# EasyEDA Pro project TinyFOC一体驱动板.epro

# Schematic Schematic1
Create Date: 2025-08-07; Page Name: P1; Project Name: FOC一体驱动板; Schematic Name: Schematic1; Update Date: 2025-08-23; Company: 湖南师范大学; Page Size: A4; Version: V1.0
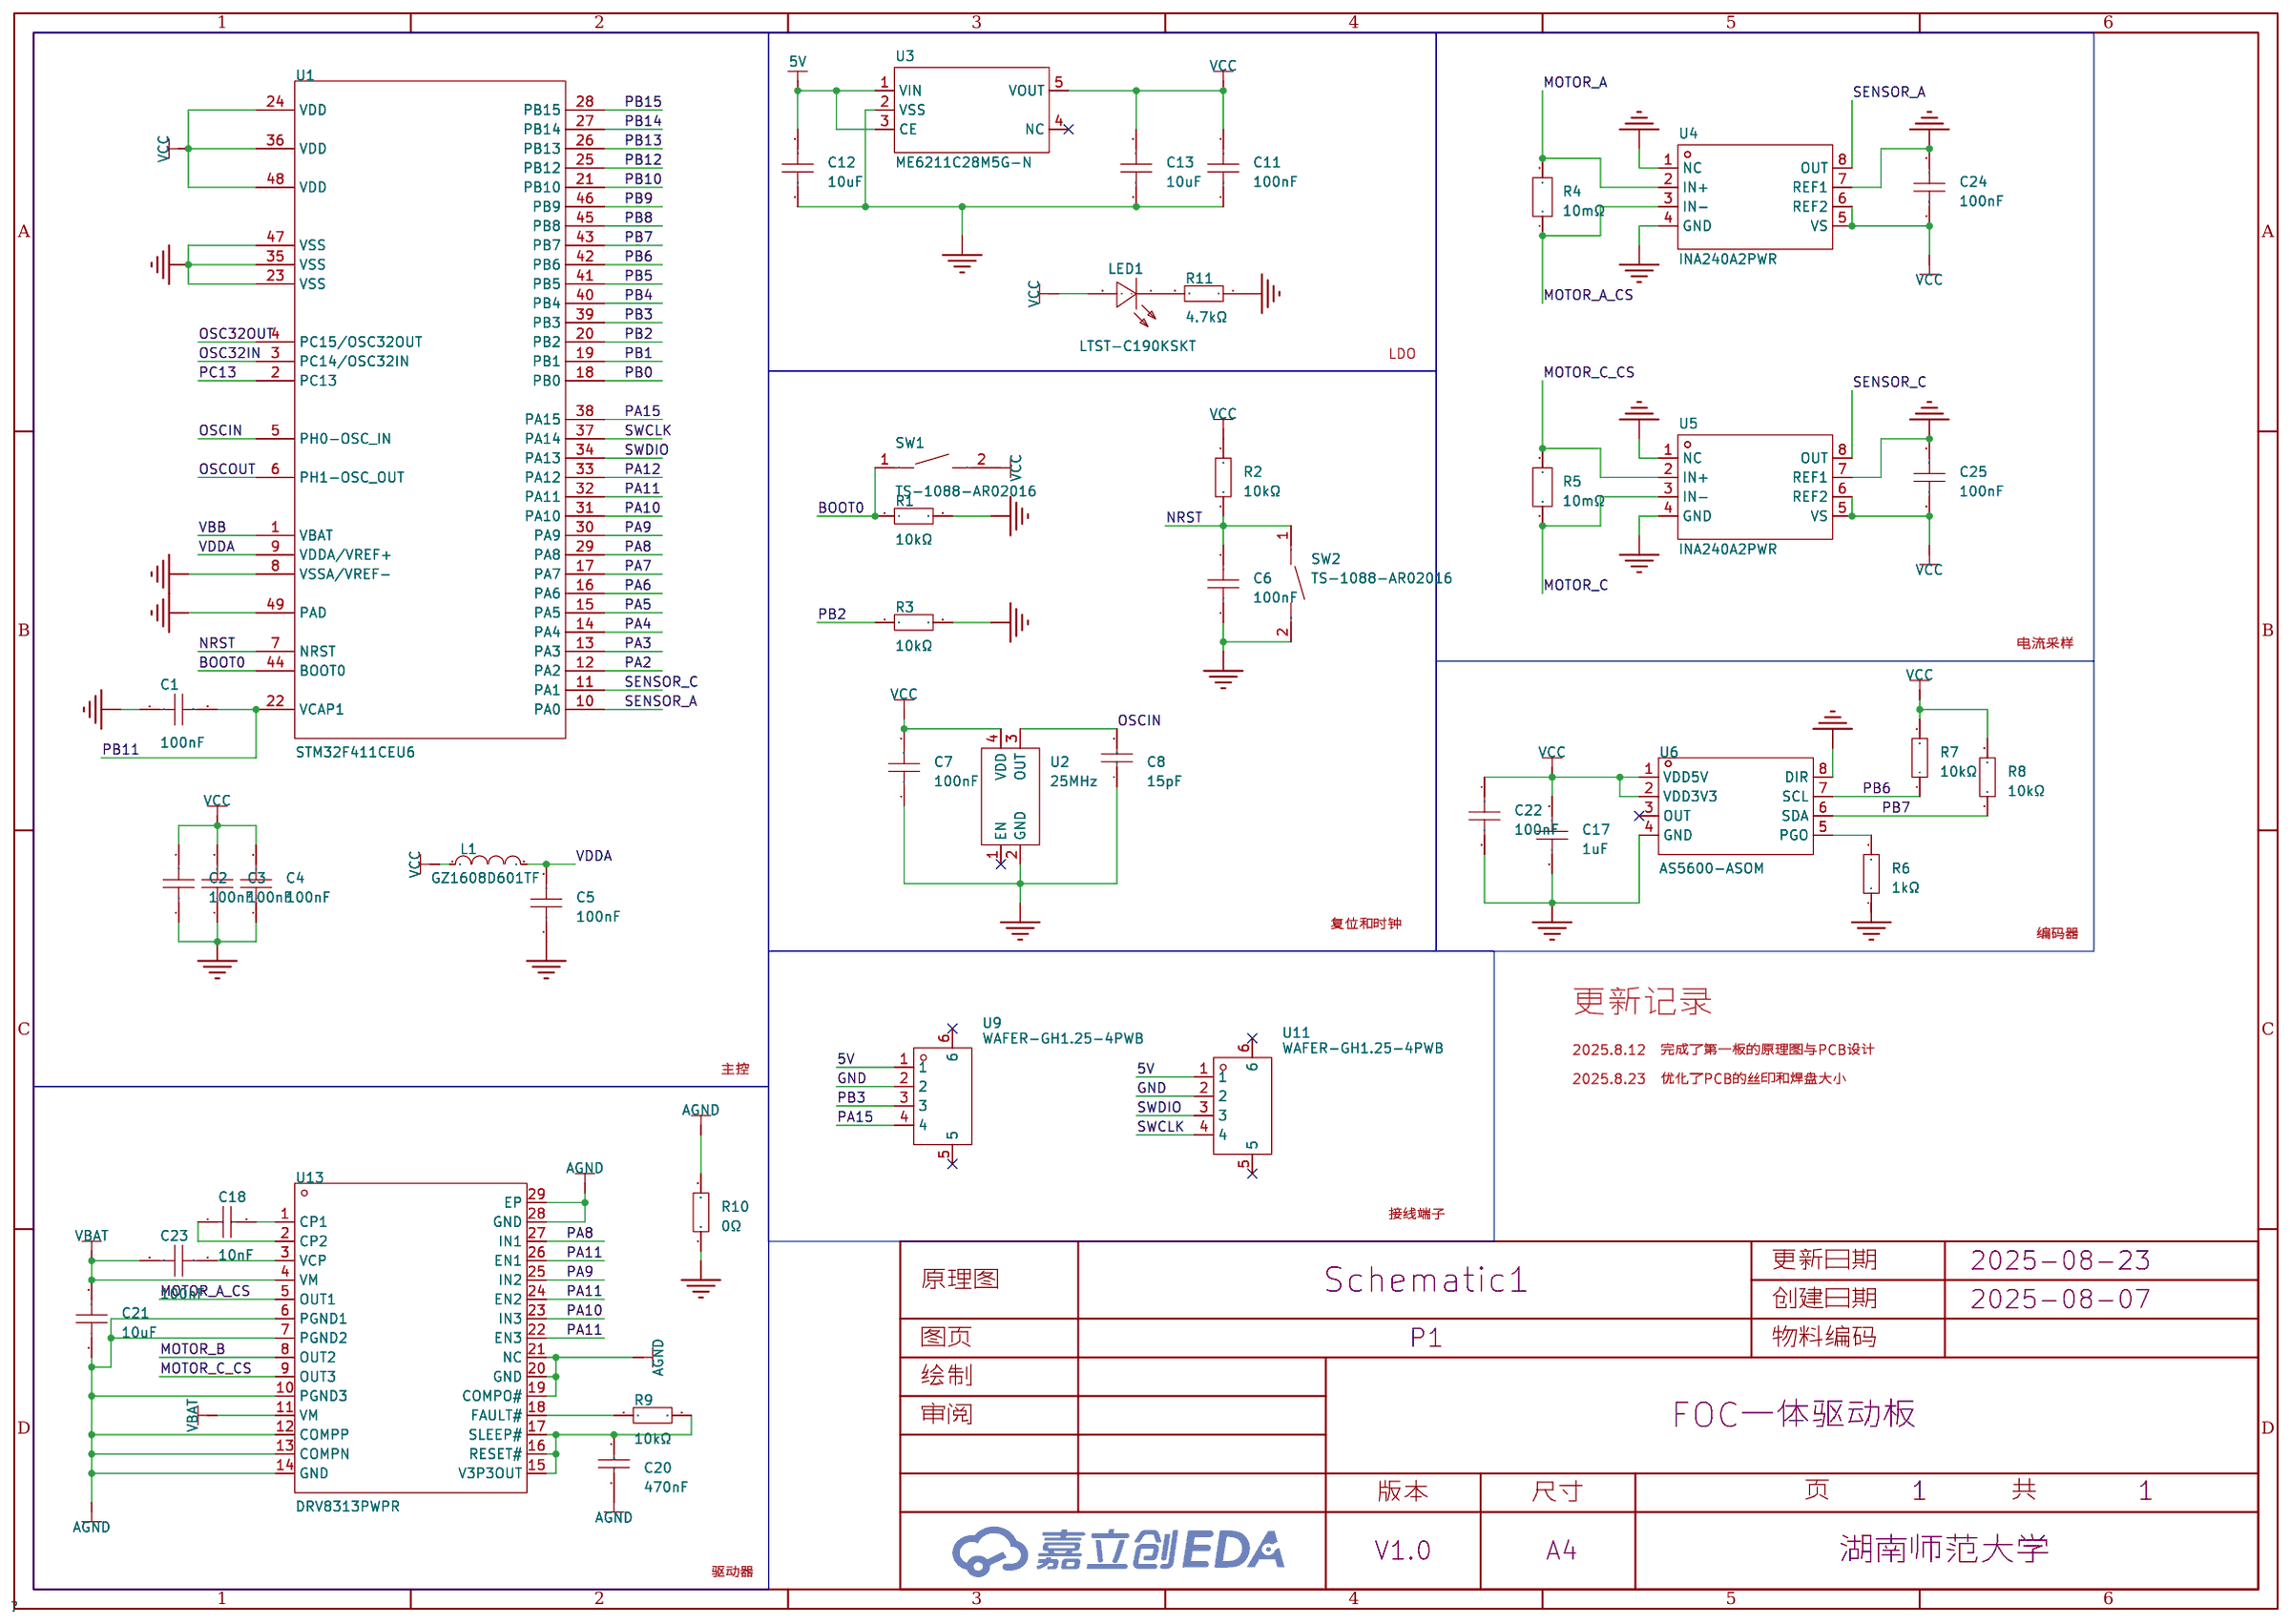
[diagram p0: schematic sheet]

## Parts
C1  100nF  [C0603]
C2  100nF  [C0603]
C3  100nF  [C0603]
C4  100nF  [C0603]
C5  100nF  [C0603]
C6  100nF  [C0603]
C7  100nF  [C0603]
C8  15pF  [C0603]
C11  100nF  [C0603]
C12  10uF  [C0603]
C13  10uF  [C0603]
C17  1uF  [C0603]
C18  10nF  [C0805]
C20  470nF  [C0603]
C21  10uF  [C0603]
C22  100nF  [C0603]
C23  100nF  [C0603]
C24  100nF  [C0603]
C25  100nF  [C0603]
L1  GZ1608D601TF  [L0603]
LED1  LTST-C190KSKT  [LED0603-RD]
R1  10kΩ  [R0603]
R2  10kΩ  [R0603]
R3  10kΩ  [R0603]
R4  10mΩ  [R1206]
R5  10mΩ  [R1206]
R6  1kΩ  [R0603]
R7  10kΩ  [R0603]
R8  10kΩ  [R0603]
R9  10kΩ  [R0603]
R10  0Ω  [R0603]
R11  4.7kΩ  [R0603]
SW1  TS-1088-AR02016  [SW-SMD_L3.9-W3.0-P4.45]
SW2  TS-1088-AR02016  [SW-SMD_L3.9-W3.0-P4.45]
U1  STM32F411CEU6  [UFQFPN-48_L7.0-W7.0-P0.50-BL-EP]
U2  25MHz  [OSC-SMD_4P-L2.0-W1.6-BL]
U3  ME6211C28M5G-N  [SOT-23-5_L3.0-W1.7-P0.95-LS2.8-BR]
U4  INA240A2PWR  [TSSOP-8_L4.4-W3.0-P0.65-LS6.4-BL]
U5  INA240A2PWR  [TSSOP-8_L4.4-W3.0-P0.65-LS6.4-BL]
U6  AS5600-ASOM  [SOIC-8_L5.0-W4.0-P1.27-LS6.0-BL]
U9  WAFER-GH1.25-4PWB  [CONN-SMD_4P-P1.25_XUNPU_WAFER-GH1.25-4PWB]
U11  WAFER-GH1.25-4PWB  [CONN-SMD_4P-P1.25_XUNPU_WAFER-GH1.25-4PWB]
U13  DRV8313PWPR  [HTSSOP-28_L9.8-W4.5-P0.65-LS6.6-BL-EP]

## Library data of the parts
C1-C7 C11 C22-C25 = CGA0603X7R104K500JT: 容值:100nF;精度:±10%;额定电压:50V;温度系数:X7R;; LCSC Part Name: 100nF ±10% 50V; Supplier Part: C6119867; Manufacturer: HRE(芯声); Supplier Footprint: 0603; JLCPCB Part Class: 扩展库; Datasheet: https://atta.szlcsc.com/upload/public/pdf/source/20250103/C44077DA9E7B3EFAE02F22B6D3D1CBC9.pdf; Supplier: LCSC; Tolerance: ±10%; Voltage Rating: 50V; Temperature Coefficient: X7R
C8 = CL10C150JB8NNNC: 容值:15pF;精度:±5%;额定电压:50V;材质(温度系数):C0G;; LCSC Part Name: 15pF ±5% 50V; Supplier Part: C1644; Manufacturer: SAMSUNG(三星); Supplier Footprint: 0603; JLCPCB Part Class: 基础库; Datasheet: https://atta.szlcsc.com/upload/public/pdf/source/20160218/1457707763339.pdf; Supplier: LCSC; Tolerance: ±5%; Voltage Rated: 50V; Temperature Coefficient: C0G
C12 C13 = CL10A106KP8NNNC: 容值:10uF;精度:±10%;额定电压:10V;材质(温度系数):X5R;; LCSC Part Name: 10uF ±10% 10V; Supplier Part: C19702; Manufacturer: SAMSUNG(三星); Supplier Footprint: 0603; JLCPCB Part Class: 基础库; Datasheet: https://atta.szlcsc.com/upload/public/pdf/source/20160218/1457707763339.pdf; Supplier: LCSC; Tolerance: ±10%; Voltage Rated: 10V; Temperature Coefficient: X5R
C17 = CL10A105KB8NNNC: 容值:1uF;精度:±10%;额定电压:50V;材质(温度系数):X5R;; LCSC Part Name: 1uF ±10% 50V; Supplier Part: C15849; Manufacturer: SAMSUNG(三星); Supplier Footprint: 0603; JLCPCB Part Class: 基础库; Datasheet: https://atta.szlcsc.com/upload/public/pdf/source/20160218/1457707763339.pdf; Supplier: LCSC; Tolerance: ±10%; Voltage Rated: 50V; Temperature Coefficient: X5R
C18 = CL21B103KBANNNC: 容值:10nF;精度:±10%;额定电压:50V;材质(温度系数):X7R;; LCSC Part Name: 10nF ±10% 50V; Supplier Part: C1710; Manufacturer: SAMSUNG(三星); Supplier Footprint: 0805; JLCPCB Part Class: Basic Part; Datasheet: https://atta.szlcsc.com/upload/public/pdf/source/20160218/1457707763339.pdf; Supplier: LCSC; Tolerance: ±10%; Voltage Rated: 50V; Temperature Coefficient: X7R
C20 = CL10B474KA8NNNC: 容值:470nF;精度:±10%;额定电压:25V;材质(温度系数):X7R;; LCSC Part Name: 470nF ±10% 25V; Supplier Part: C1623; Manufacturer: SAMSUNG(三星); Supplier Footprint: 0603; JLCPCB Part Class: 基础库; Datasheet: https://atta.szlcsc.com/upload/public/pdf/source/20160218/1457707763339.pdf; Supplier: LCSC; Tolerance: ±10%; Voltage Rated: 25V; Temperature Coefficient: X7R
C21 = CL10A106MA8NRNC: 容值:10uF;精度:±20%;额定电压:25V;材质(温度系数):X5R;; LCSC Part Name: 10uF ±20% 25V; Supplier Part: C96446; Manufacturer: SAMSUNG(三星); Supplier Footprint: 0603; JLCPCB Part Class: 基础库; Datasheet: https://atta.szlcsc.com/upload/public/pdf/source/20160218/1457707763339.pdf; Supplier: LCSC; Tolerance: ±20%; Voltage Rated: 25V; Temperature Coefficient: X5R
L1 = GZ1608D601TF: 阻抗 @ 频率:600Ω@100MHz;误差:±25%;直流电阻(DCR):450mΩ;; LCSC Part Name: 单路 0603磁珠 阻抗600Ω@100MHz; Supplier Part: C1002; Manufacturer: Sunlord(顺络); Supplier Footprint: 0603; JLCPCB Part Class: 基础库; Datasheet: https://atta.szlcsc.com/upload/public/pdf/source/20241120/893429B990C3BA07384E734821D2F218.pdf; Supplier: LCSC; Impedance @ Frequency: 600Ω@100MHz; Tolerance: ±25%; DC Resistance: 450mΩ; Current Rating: 200mA; Circuits: 1
LED1 = LTST-C190KSKT: 发光颜色:黄色;正向电压(VF):2.1V;功率:75mW;正向电流:20mA;主波长:584.5nm~597nm;二极管配置:-;透镜颜色:无色透明透镜;色温:-;发光强度:104mcd;发光角度:130°;载带方式:-;工作温度:-30℃~+85℃;; LCSC Part Name: 黄灯; Supplier Part: C125095; Manufacturer: LITEON(光宝); Supplier Footprint: 0603; JLCPCB Part Class: 扩展库; Datasheet: https://atta.szlcsc.com/upload/public/pdf/source/20180129/C125095_15171881843821315881.pdf; Supplier: LCSC; Emitted Color: 黄色; Forward Voltage (VF): 2.1V; Power Dissipation: 75mW; Forward Current: 20mA; Dominant Wavelength: 584.5nm~597nm; Peak Wavelength: 588nm; Lens Color: 无色透明透镜; Luminous Intensity: 104mcd; Viewing Angle: 130°; Operating Temperature: -30℃~+85℃
R1-R3 R7-R9 = 0603WAF1002T5E: 电阻类型:厚膜电阻;阻值:10kΩ;精度:±1%;功率:100mW;工作电压:75V;温度系数:±100ppm/℃;; LCSC Part Name: 厚膜电阻 10kΩ ±1% 100mW; Supplier Part: C25804; Manufacturer: UNI-ROYAL(厚声); Supplier Footprint: 0603; JLCPCB Part Class: 基础库; Datasheet: https://atta.szlcsc.com/upload/public/pdf/source/20200306/C422600_1E6D84923E4A46A82E41ADD87F860B5C.pdf; Supplier: LCSC; Type: 厚膜电阻; Tolerance: ±1%; Power(Watts): 100mW; Voltage-Supply(Max): 75V; Temperature Coefficient: ±100ppm/℃; Operating Temperature: -55℃~+155℃
R4 R5 = JER1206F1R010: 电阻类型:采样电阻;阻值:10mΩ;精度:±1%;功率:1W;温度系数:±50ppm/℃;; LCSC Part Name: 10mΩ 1W 1206 ±1%; Supplier Part: C46634437; Manufacturer: 捷而瑞; Supplier Footprint: 1206; JLCPCB Part Class: 扩展库; Datasheet: https://atta.szlcsc.com/upload/public/pdf/source/20250318/D554CC95569B02A455FAE3D181D671EA.pdf; Supplier: LCSC; Type: 采样电阻; Tolerance: ±1%; Power(Watts): 1W; Temperature Coefficient: ±50ppm/℃
R6 = 0603WAF1001T5E: 电阻类型:厚膜电阻;阻值:1kΩ;精度:±1%;功率:100mW;最大工作电压:75V;温度系数:±100ppm/℃;; LCSC Part Name: 1kΩ ±1% 100mW 厚膜电阻; Supplier Part: C21190; Manufacturer: UNI-ROYAL(厚声); Supplier Footprint: 0603; JLCPCB Part Class: 基础库; Datasheet: https://atta.szlcsc.com/upload/public/pdf/source/20200306/C422600_1E6D84923E4A46A82E41ADD87F860B5C.pdf; Supplier: LCSC; Type: 厚膜电阻; Tolerance: ±1%; Power(Watts): 100mW; Overload Voltage (Max): 75V; Temperature Coefficient: ±100ppm/℃; Operating Temperature Range: -55℃~+155℃
R10 = 0603WAF0000T5E: 电阻类型:厚膜电阻;阻值:0Ω;精度:±1%;功率:100mW;工作电压:75V;; LCSC Part Name: 0Ω ±1% 100mW 厚膜电阻; Supplier Part: C21189; Manufacturer: UNI-ROYAL(厚声); Supplier Footprint: 0603; JLCPCB Part Class: 基础库; Datasheet: https://atta.szlcsc.com/upload/public/pdf/source/20200306/C422600_1E6D84923E4A46A82E41ADD87F860B5C.pdf; Supplier: LCSC; Type: 厚膜电阻; Tolerance: ±1%; Power(Watts): 100mW; Voltage-Supply(Max): 75V; Operating Temperature: -55℃~+155℃
R11 = 0603WAF4701T5E: 电阻类型:厚膜电阻;阻值:4.7kΩ;精度:±1%;功率:100mW;最大工作电压:75V;温度系数:±100ppm/℃;; LCSC Part Name: 4.7kΩ ±1% 100mW 厚膜电阻; Supplier Part: C23162; Manufacturer: UNI-ROYAL(厚声); Supplier Footprint: 0603; JLCPCB Part Class: 基础库; Datasheet: https://atta.szlcsc.com/upload/public/pdf/source/20200306/C422600_1E6D84923E4A46A82E41ADD87F860B5C.pdf; Supplier: LCSC; Type: 厚膜电阻; Tolerance: ±1%; Power(Watts): 100mW; Overload Voltage (Max): 75V; Temperature Coefficient: ±100ppm/℃; Operating Temperature Range: -55℃~+155℃
SW1 SW2 = TS-1088-AR02016: 电路结构:单刀单掷;按钮形状:圆形按钮;作用力:160gf;安装方式:立贴;开关长度:4mm;开关宽度:3mm;开关高度:2mm;带支架:不带;触点电流:50mA;额定电压(DC):12V;绝缘电阻:100MΩ;机械寿命:10万次;; LCSC Part Name: 4*3*2mm 立贴 轻触开关; Supplier Part: C720477; Manufacturer: XUNPU(讯普); Supplier Footprint: SMD; JLCPCB Part Class: 基础库; Datasheet: https://atta.szlcsc.com/upload/public/pdf/source/20200810/C720475_60D09DD6C54279ADDB2DC25100F1CC11.pdf; Supplier: LCSC; Circuit: 单刀单掷; Actuator Style: 圆形按钮; Operating Force: 160gf; Mounting Style: 立贴; Switch Length: 4mm; Switch Width: 3mm; Switch Height: 2mm; Strike Gundam: 不带; Contact Current: 50mA; Voltage Rating (DC): 12V; Insulation Resistance: 100MΩ; Actuator/Cap Color: 黑色; Pin Style: SMD接片; Mechanical Life: 10万次; Operating Temperature: -30℃~+80℃
U1 = STM32F411CEU6: CPU内核:ARM-M4;CPU最大主频:100MHz;应用领域:-;; LCSC Part Name: 带DSP和FPU的高性能基本型系列ARM Cortex-M4 MCU，具有512 KB Flash、100 MHz CPU和ART加速器; Supplier Part: C60420; Manufacturer: ST(意法半导体); Supplier Footprint: UFQFPN-48(7x7); JLCPCB Part Class: 扩展库; Datasheet: https://atta.szlcsc.com/upload/public/pdf/source/20151026/1457707507170.pdf; Supplier: LCSC; CPU Core: ARM-M4; CPU Maximum Speed: 100MHz; Program Storage Size: 512KB; Program Memory Type: FLASH; Number of I/O: 36; ADC (Bit): 12bit; Voltage - Supply: 1.7V~3.6V
U2 = 8T025000301: 频率:25MHz;; LCSC Part Name: 25M 3.3V -40~85度30ppm; Supplier Part: C5184806; Manufacturer: HD(浩都频率); Supplier Footprint: SMD2016-4P; JLCPCB Part Class: 扩展库; Datasheet: https://atta.szlcsc.com/upload/public/pdf/source/20221108/A0608134A307B3F202D8F841D0A911F4.pdf; Supplier: LCSC
U3 = ME6211C28M5G-N: 输出类型:固定;工作电压:6V;输出电压:2.8V;输出电流:450mA;电源纹波抑制比(PSRR):70dB@(1kHz);输出极性:正极;; LCSC Part Name: 输入6V 输出2.8V 450mA; Supplier Part: C53099; Manufacturer: MICRONE(南京微盟); Supplier Footprint: SOT-23-5; JLCPCB Part Class: 扩展库; Datasheet: https://atta.szlcsc.com/upload/public/pdf/source/20171014/C53099_15079757529561038531.pdf; Supplier: LCSC; Output Type: 固定; Voltage - Supply: 6V; Output Voltage: 2.8V; Output Current: 450mA; Power Supply Rejection Ratio (PSRR): 70dB@(1kHz); Voltage Dropout: 220mV@(200mA); Features: 低ESR；带使能; Output Configuration: 正极; Number of Outputs: 1
U4 U5 = INA240A2PWR: 放大器数:单路;; Supplier Part: C129949; Manufacturer: TI(德州仪器); Supplier Footprint: TSSOP-8; JLCPCB Part Class: 扩展库; Datasheet: https://www.ti.com/cn/lit/gpn/ina240; Supplier: LCSC; Number of Channels: 单路; Supply Current: 1.8mA; Operating Temperature: -40℃~+125℃
U6 = AS5600-ASOM: 旋转角度范围:0°~360°;; Supplier Part: C79815; Manufacturer: ams(艾迈斯半导体); Supplier Footprint: SOIC-8; JLCPCB Part Class: 扩展库; Datasheet: https://atta.szlcsc.com/upload/public/pdf/source/20161027/1477535527192.pdf; Supplier: LCSC; Supply Voltage: 5V；3.3V; Rotation Angle: 0°~360°
U9 U11 = WAFER-GH1.25-4PWB: 插针结构:1x4P;间距:1.25mm;安装方式:卧贴;参考系列:GH;总PIN数:4P;排数:1;每排PIN数:4;行距:-;额定电流:1A;触头材质:黄铜;触头镀层:-;工作温度范围:-25℃~+85℃;; LCSC Part Name: 1x4P 间距:1.25mm 卧贴 系列:GH; Supplier Part: C3029379; Manufacturer: XUNPU(讯普); Supplier Footprint: SMD,P=1.25mm,卧贴; JLCPCB Part Class: 扩展库; Datasheet: https://atta.szlcsc.com/upload/public/pdf/source/20220527/CB8773BFB0913C3B8ABD62CB38BA101A.pdf; Supplier: LCSC; Pins Structure: 1x4P; Pitch: 1.25mm; Mounting Type: 卧贴; Reference Series: GH; Number of Pins: 4P; Number of Rows: 1; Number of PINs Per Row: 4; Current Rating: 1A; Contact Material: 黄铜; Operating Temperature: -25℃~+85℃; Voltage Rating: 125V; Plastic Material: LCP; Supplementary Features: 辅助焊脚; Color: 米色; Z-Height of the Board: 4.35mm; X-Length of Bottom Edge on Board (Spacing Line): 8.25mm; Y-Width of Bottom Edge on Board: 5mm
U13 = DRV8313PWPR: DRV8313 具有集成 FET、65V 最大电压、3A 峰值电流的三相电机驱动器; LCSC Part Name: 无刷直流BLDC电机驱动芯片 60V; Supplier Part: C92482; Manufacturer: TI(德州仪器); Supplier Footprint: HTSSOP-28-EP-4.5mm; JLCPCB Part Class: 扩展库; Datasheet: https://www.ti.com/cn/lit/gpn/drv8313; Supplier: LCSC

## Nets
5V: C12.2 U3.1(VIN) U3.3(CE) U9.1 U11.1
AGND: C20.1 C21.1 R10.2 U13.6(PGND1) U13.7(PGND2) U13.10(PGND3) U13.12(COMPP) U13.13(COMPN) U13.14(GND) U13.19(COMPO#) U13.20(GND) U13.21(NC) U13.28(GND) U13.29(EP)
GND: C1.1 C2.1 C3.1 C4.1 C5.1 C6.2 C7.1 C8.1 C11.1 C12.1 C13.1 C17.1 C22.2 C24.2 C25.2 R1.2 R3.2 R6.1 R10.1 R11.1 SW2.2 U1.8(VSSA/VREF-) U1.23(VSS) U1.35(VSS) U1.47(VSS) U1.49(PAD) U2.2(GND) U3.2(VSS) U4.1(NC) U4.4(GND) U4.7(REF1) U5.1(NC) U5.4(GND) U5.7(REF1) U6.4(GND) U6.8(DIR) U9.2 U11.2
VBAT: C21.2 C23.2 U13.4(VM) U13.11(VM)
VCC: C2.2 C3.2 C4.2 C7.2 C11.2 C13.2 C17.2 C22.1 C24.1 C25.1 L1.1 LED1.2(+) R2.1 R7.2 R8.2 SW1.2 U1.24(VDD) U1.36(VDD) U1.48(VDD) U2.4(VDD) U3.5(VOUT) U4.5(VS) U4.6(REF2) U5.5(VS) U5.6(REF2) U6.1(VDD5V) U6.2(VDD3V3)
VDDA: C5.2 L1.2 U1.9(VDDA/VREF+)
BOOT0: R1.1 SW1.1 U1.44(BOOT0)
MOTOR_A: R4.2 U4.2(IN+)
MOTOR_A_CS: R4.1 U4.3(IN-) U13.5(OUT1)
MOTOR_B: U13.8(OUT2)
MOTOR_C: R5.1 U5.3(IN-)
MOTOR_C_CS: R5.2 U5.2(IN+) U13.9(OUT3)
NRST: C6.1 R2.2 SW2.1 U1.7(NRST)
OSC32IN: U1.3(PC14/OSC32IN)
OSC32OUT: U1.4(PC15/OSC32OUT)
OSCIN: C8.2 U1.5(PH0-OSC_IN) U2.3(OUT)
OSCOUT: U1.6(PH1-OSC_OUT)
PA2: U1.12(PA2)
PA3: U1.13(PA3)
PA4: U1.14(PA4)
PA5: U1.15(PA5)
PA6: U1.16(PA6)
PA7: U1.17(PA7)
PA8: U1.29(PA8) U13.27(IN1)
PA9: U1.30(PA9) U13.25(IN2)
PA10: U1.31(PA10) U13.23(IN3)
PA11: U1.32(PA11) U13.22(EN3) U13.24(EN2) U13.26(EN1)
PA12: U1.33(PA12)
PA15: U1.38(PA15) U9.4
PB0: U1.18(PB0)
PB1: U1.19(PB1)
PB2: R3.1 U1.20(PB2)
PB3: U1.39(PB3) U9.3
PB4: U1.40(PB4)
PB5: U1.41(PB5)
PB6: R7.1 U1.42(PB6) U6.7(SCL)
PB7: R8.1 U1.43(PB7) U6.6(SDA)
PB8: U1.45(PB8)
PB9: U1.46(PB9)
PB10: U1.21(PB10)
PB11: C1.2 U1.22(VCAP1)
PB12: U1.25(PB12)
PB13: U1.26(PB13)
PB14: U1.27(PB14)
PB15: U1.28(PB15)
PC13: U1.2(PC13)
SENSOR_A: U1.10(PA0) U4.8(OUT)
SENSOR_C: U1.11(PA1) U5.8(OUT)
SWCLK: U1.37(PA14) U11.4
SWDIO: U1.34(PA13) U11.3
VBB: U1.1(VBAT)
$1N2682: R6.2 U6.5(PGO)
$1N3815: C18.2 U13.1(CP1)
$1N3819: C18.1 U13.2(CP2)
$1N3846: C23.1 U13.3(VCP)
$1N3991: R9.1 U13.18(FAULT#)
$1N3994: C20.2 R9.2 U13.15(V3P3OUT) U13.16(RESET#) U13.17(SLEEP#)
$1N4536: LED1.1(-) R11.2

Not connected (* = marked no-connect by the designer): U2 1(EN)*; U3 4(NC)*; U6 3(OUT)*; U9 5* 6*; U11 5* 6*

## Notes on the sheet
- LDO
- 电流采样
- 复位和时钟
- 编码器
- 更新记录
- 2025.8.12  完成了第一板的原理图与PCB设计
- 主控
- 2025.8.23  优化了PCB的丝印和焊盘大小
- 接线端子
- 驱动器

# Board PCB1
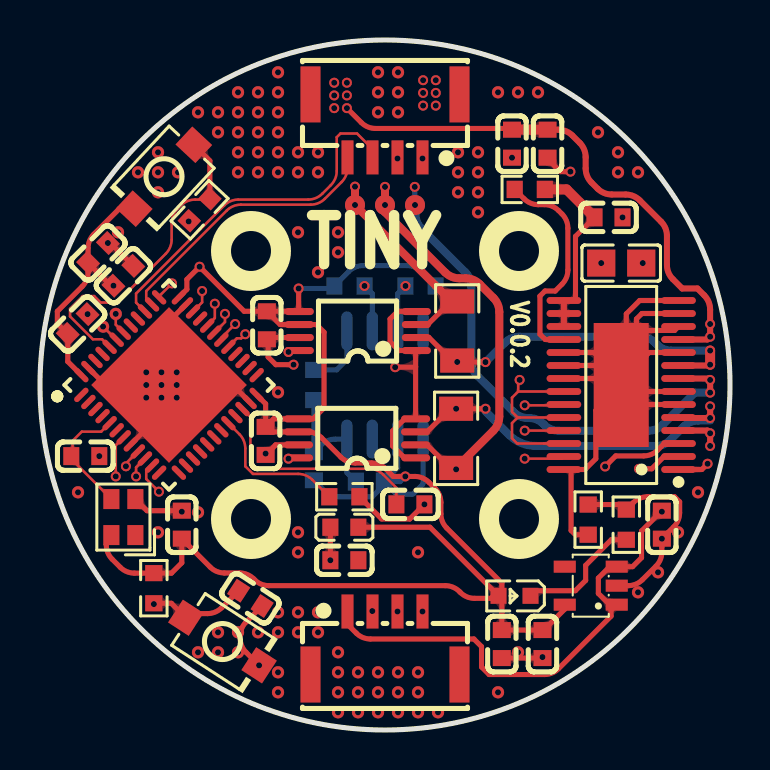
[diagram p1: board, top side]
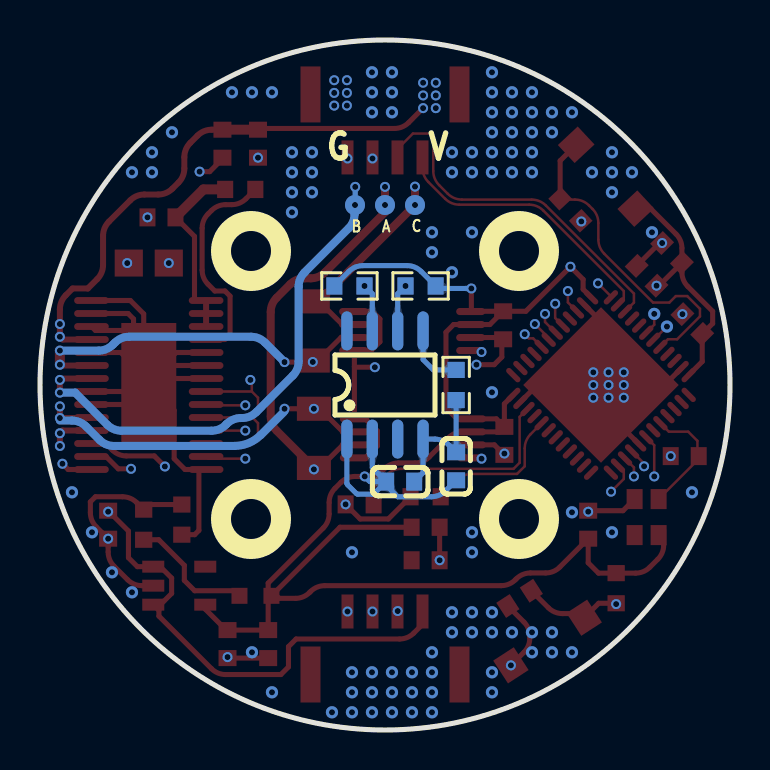
[diagram p2: board, bottom side, seen from below]

Outline 34.5 x 34.5 mm; copper layers: Top Layer, Inner1, Inner2, Bottom Layer. Coordinates in mm from the lower left corner of the outline.
Outline path: circle c17.25,17.25 r17.25
Stack: Top Layer 0.035mm 外层铜厚1oz / Dielectric1 0.2104mm 7628 RC49% 8.6mil / Inner1 0.0152mm 内层铜厚 / Dielectric2 1.065mm 1.1mm H/HOZ 含铜 / Inner2 0.0152mm 内层铜厚 / Dielectric3 0.2104mm 7628 RC49% 8.6mil / Bottom Layer 0.035mm 外层铜厚1oz

## Design rules (mm)
template: JLCPCB Capability(Two Layers Board)
spacing copperThickness1oz (default): track to track 0.102, other pairs 0.152 to 0.3
spacing copperThickness2oz: track to track 0.203, other pairs 0.152 to 0.3
track width copperThickness1oz (default): min 0.127, default 0.254, max 2.54
track width copperThickness2oz: min 0.203, default 0.254, max 2.54
differential pair differentialPair (default): width min 0.127, default 0.254, max 2.54; gap min 0.152, default 0.152
via viaSize (default): diameter min 0.5, default 0.61, max 10; hole min 0.3, default 0.305, max 6.3

## Placement (name value [footprint] x y rotation side)
C1  100nF  [C0603]  18.52 11.28 180 top
C2  100nF  [C0603]  4.17 22.71 225 top
C3  100nF  [C0603]  2.9 23.85 225 top
C4  100nF  [C0603]  1.88 20.3 225 top
C5  100nF  [C0603]  15.22 8.49 180 top
C6  100nF  [C0603]  10.52 6.58 327 top
C7  100nF  [C0603]  7.09 10.27 270 top
C8  15pF  [C0603]  2.26 13.69 180 top
C11  100nF  [C0603]  23.09 4.3 90 top
C12  10uF  [C0603]  31.09 10.27 90 top
C13  10uF  [C0603]  25.12 4.3 90 top
C17  1uF  [C0603]  16.49 12.42 0 bottom
C18  10nF  [C0805]  29.06 23.35 180 top
C20  470nF  [C0603]  28.43 25.63 180 top
C21  10uF  [C0603]  23.6 29.31 90 top
C22  100nF  [C0603]  13.69 13.19 90 bottom
C23  100nF  [C0603]  25.38 29.31 90 top
C24  100nF  [C0603]  11.28 14.46 270 top
C25  100nF  [C0603]  11.34 20.24 270 top
L1  GZ1608D601TF  [L0603]  15.22 10.14 180 top
LED1  LTST-C190KSKT  [LED0603-RD]  23.73 6.71 180 top
R1  10kΩ  [R0603]  7.98 26.01 227 top
R2  10kΩ  [R0603]  5.69 7.09 270 top
R3  10kΩ  [R0603]  15.22 11.66 0 top
R4  10mΩ  [R1206]  20.81 14.58 270 top
R5  10mΩ  [R1206]  20.86 19.95 270 top
R6  1kΩ  [R0603]  13.69 17.25 90 bottom
R7  10kΩ  [R0603]  19.03 22.2 0 bottom
R8  10kΩ  [R0603]  15.47 22.2 180 bottom
R9  10kΩ  [R0603]  24.49 27.03 0 top
R10  0Ω  [R0603]  27.41 10.52 270 top
R11  4.7kΩ  [R0603]  29.31 10.27 270 top
SW1  TS-1088-AR02016  [SW-SMD_L3.9-W3.0-P4.45]  6.2 27.66 227 top
SW2  TS-1088-AR02016  [SW-SMD_L3.9-W3.0-P4.45]  9.12 4.42 327 top
U1  STM32F411CEU6  [UFQFPN-48_L7.0-W7.0-P0.50-BL-EP]  6.45 17.25 315 top
U2  25MHz  [OSC-SMD_4P-L2.0-W1.6-BL]  4.17 10.65 90 top
U3  ME6211C28M5G-N  [SOT-23-5_L3.0-W1.7-P0.95-LS2.8-BR]  27.54 7.22 0 top
U4  INA240A2PWR  [TSSOP-8_L4.4-W3.0-P0.65-LS6.4-BL]  15.85 14.58 90 top
U5  INA240A2PWR  [TSSOP-8_L4.4-W3.0-P0.65-LS6.4-BL]  15.89 19.95 90 top
U6  AS5600-ASOM  [SOIC-8_L5.0-W4.0-P1.27-LS6.0-BL]  17.25 17.25 180 bottom
U9  WAFER-GH1.25-4PWB  [CONN-SMD_4P-P1.25_XUNPU_WAFER-GH1.25-4PWB]  17.25 30.2 180 top
U11  WAFER-GH1.25-4PWB  [CONN-SMD_4P-P1.25_XUNPU_WAFER-GH1.25-4PWB]  17.25 4.35 0 top
U13  DRV8313PWPR  [HTSSOP-28_L9.8-W4.5-P0.65-LS6.6-BL-EP]  29.06 17.25 90 top

## Footprints (pads in the part's own frame, mm; a bottom-side part is the same pattern mirrored in y, then rotated)
C0603
  rect 0.8x0.9 smd: 1(-0.7,0) 2(0.7,0)
C0805
  rect 1.41x1.35 smd: 1(-1,0) 2(1,0)
CONN-SMD_4P-P1.25_XUNPU_WAFER-GH1.25-4PWB
  rect 0.6x1.7 smd: 1(-1.875,1.575) 2(-0.625,1.575) 3(0.625,1.575) 4(1.875,1.575)
  rect 1x2.8 smd: 5(3.725,-1.575) 6(-3.725,-1.575)
HTSSOP-28_L9.8-W4.5-P0.65-LS6.6-BL-EP
  oval 0.343x1.732 smd: 1(-4.225,-2.866) 2(-3.575,-2.866) 3(-2.925,-2.866) 4(-2.275,-2.866) 5(-1.625,-2.866) 6(-0.975,-2.866) 7(-0.325,-2.866) 8(0.325,-2.866) 9(0.975,-2.866) 10(1.625,-2.866) 11(2.275,-2.866) 12(2.925,-2.866) 13(3.575,-2.866) 14(4.225,-2.866) 15(4.225,2.866) 16(3.575,2.866) 17(2.925,2.866) 18(2.275,2.866) 19(1.625,2.866) 20(0.975,2.866) 21(0.325,2.866) 22(-0.325,2.866) 23(-0.975,2.866) 24(-1.625,2.866) 25(-2.275,2.866) 26(-2.925,2.866) 27(-3.575,2.866) 28(-4.225,2.866)
  rect 6.2x2.75 smd: 29(0,0)
L0603
  rect 0.8x0.864 smd: 1(-0.7,0) 2(0.7,0)
LED0603-RD
  rect 0.8x0.8 smd: 1(-0.799,0) 2(0.799,0)
OSC-SMD_4P-L2.0-W1.6-BL
  rect 1x0.8 smd: 1(-0.9,-0.6) 2(0.9,-0.6) 3(0.9,0.6) 4(-0.9,0.6)
R0603
  rect 0.806x0.864 smd: 1(-0.753,0) 2(0.753,0)
R1206
  rect 1.208x1.701 smd: 1(-1.479,0) 2(1.479,0)
SOIC-8_L5.0-W4.0-P1.27-LS6.0-BL
  oval 0.569x1.95 smd: 1(-1.905,-2.705) 2(-0.635,-2.705) 3(0.635,-2.705) 4(1.905,-2.705) 5(1.905,2.705) 6(0.635,2.705) 7(-0.635,2.705) 8(-1.905,2.705)
SOT-23-5_L3.0-W1.7-P0.95-LS2.8-BR
  rect 1.1x0.6 smd: 1(1.3,-0.95) 2(1.3,0) 3(1.3,0.95) 4(-1.3,0.95) 5(-1.3,-0.95)
SW-SMD_L3.9-W3.0-P4.45
  rect 1.23x1.36 smd: 1(-2.185,0) 2(2.185,0)
TSSOP-8_L4.4-W3.0-P0.65-LS6.4-BL
  oval 0.353x1.454 smd: 1(-0.975,-2.927) 2(-0.325,-2.927) 3(0.325,-2.927) 4(0.975,-2.927) 5(0.975,2.927) 6(0.325,2.927) 7(-0.325,2.927) 8(-0.975,2.927)
UFQFPN-48_L7.0-W7.0-P0.50-BL-EP
  oval 0.28x0.9 smd: 1(-2.751,-3.45) 2(-2.251,-3.45) 3(-1.75,-3.45) 4(-1.25,-3.45) 5(-0.749,-3.45) 6(-0.249,-3.45) 7(0.249,-3.45) 8(0.75,-3.45) 9(1.25,-3.45) 10(1.75,-3.45) 11(2.251,-3.45) 12(2.751,-3.45) 25(2.751,3.449) 26(2.251,3.449) 27(1.75,3.449) 28(1.25,3.449) 29(0.75,3.449) 30(0.249,3.449) 31(-0.249,3.449) 32(-0.749,3.449) 33(-1.25,3.449) 34(-1.75,3.449) 35(-2.251,3.449) 36(-2.751,3.449)
  oval 0.9x0.28 smd: 13(3.45,-2.751) 14(3.45,-2.251) 15(3.45,-1.75) 16(3.45,-1.25) 17(3.45,-0.75) 18(3.45,-0.249) 19(3.45,0.249) 20(3.45,0.749) 21(3.45,1.25) 22(3.45,1.75) 23(3.45,2.251) 24(3.45,2.751) 37(-3.449,2.751) 38(-3.449,2.251) 39(-3.449,1.75) 40(-3.449,1.25) 41(-3.449,0.749) 42(-3.449,0.249) 43(-3.449,-0.249) 44(-3.449,-0.75) 45(-3.449,-1.25) 46(-3.449,-1.75) 47(-3.449,-2.251) 48(-3.449,-2.751)
  rect 5.5x5.5 smd: 49(0,0)

## Nets
As in the schematic.

Pads without a net: U2 1; U3 4; U6 3; U9 5 6; U11 5 6

## Via types
v1: diameter 0.5, hole 0.305, Top Layer to Bottom Layer, 88 vias
v2: diameter 0.61, hole 0.304, Top Layer to Bottom Layer, 97 vias
v3: diameter 1, hole 0.305, Top Layer to Bottom Layer, 3 vias
v4: diameter 0.5, hole 0.3, Top Layer to Bottom Layer, 1 via
v5: diameter 0.61, hole 0.305, Top Layer to Bottom Layer, 2 vias

## Routing (per net, layer and track width the routed paths; a pad name or vN(x,y) marks a point on that pad's centre or on a via; arc(x,y) is an arc through that point)
5V: length 48.8
  Top Layer w0.254: U11.1 15.38,5.28 15.81,4.84 arc(16.14,4.63) 16.52,4.55 21.69,4.55 22.08,4.17 22.08,3.15 22.46,2.77 25.22,2.77 arc(25.6,2.85) 25.93,3.06 28.55,5.69 28.55,5.98 U3.1 28.48,6.27 27.92,6.83 27.92,7.6 28.49,8.17 U3.3 29.63,8.17 30.08,8.61 30.08,9.95 C12.2
  Inner1 w0.4: v1(19.12,28.58) 19.5,28.2 arc(19.71,27.88) 19.79,27.5 19.79,23.63 arc(19.87,23.25) 20.08,22.93 25.09,17.92 arc(25.3,17.6) 25.38,17.22 25.38,13.98 arc(25.45,13.6) 25.67,13.27 27.75,11.19 arc(28.08,10.98) 28.46,10.9 31.11,10.9 v1(31.09,10.92)
AGND: length 30.4
  Top Layer w0.254: 28.15,16.34 27.79,15.98 27.79,13.57 27.25,13.03 26.56,13.03 ; 31.93,16.28 30.04,16.28 29.97,16.34 ; 31.93,16.92 30.11,16.92 ; 28.15,18.16 28.09,18.22 U13.20 ; 29.82,19.98 31.73,19.98 31.93,20.17 ; 29.82,19.98 29.82,19.27 ; 29.82,19.98 29.82,20.55 30.1,20.83 31.93,20.83 ; 31.93,18.88 30.46,18.88 30.08,18.5 ; R10.2 26.77,9.77 26.56,9.98 26.56,13.03 ; 31.93,21.47 29.98,21.47 29.31,20.81 29.31,19.27 ; U13.21 28.01,17.58 ; 26.56,13.03 U13.28 ; 28.02,18.55 27.69,18.88 U13.19
  vias: v1(19.16,32.49) v1(19.16,31.86) v1(19.16,31.22) v1(19.79,32.49) v1(19.79,31.86) v1(19.79,31.22) v1(23.6,28.61) v1(29.13,25.63)
GND: length 66.7
  Top Layer w0.254: C7.1 5.35,10.97 U2.2 ; v1(3.39,24.35) 3.52,24.35 C2.1 ; U1.47 3.27,17.25 v1(5.31,17.25) v1(6.07,17.25) U1.49 ; v1(12.68,18.27) 11.79,18.27 11.41,18.65 11.41,19.47 C25.2 11.43,19.62 12.96,19.62 ; 18.78,18.16 18.76,18.14 v1(17.76,18.14) ; 18.78,18.16 18.78,18.94 U5.1 17.94,18.97 17.5,19.41 17.5,20.55 17.88,20.93 18.81,20.93 18.82,20.92 ; 18.78,18.16 U4.4 18.24,15.56 17.63,14.95 17.63,14.2 18.22,13.61 U4.1 ; C6.2 10.3,5.4 arc(10.09,5.07) 10.01,4.69 10.01,4.59 arc(10.09,4.21) 10.3,3.88 v1(10.95,3.23) ; U3.2 29.41,7.22 arc(29.79,7.29) 30.12,7.51 30.8,8.19 arc(31.02,8.52) 31.09,8.9 31.09,9.15 arc(31.11,9.35) 31.17,9.53 arc(31.26,9.71) 31.39,9.86 31.69,10.16 arc(31.91,10.49) 31.98,10.87 31.98,11.41 31.73,11.66 30.37,11.66 arc(29.99,11.59) 29.67,11.37 R11.1 29.06,11.27 R10.1 ; U1.23 9.63,17.25 v1(6.84,17.25) U1.49 ; R3.2 17.08,10.55 18.49,10.55 v1(19.22,11.28) ; v1(11.28,13.82) C24.2 11.78,14.26 U4.7 ; U1.49 6.45,20.43 U1.35 ; U1.49 6.45,16.19 4.54,14.28 ; C11.1 C13.1
  Bottom Layer w0.254: R6.1 C22.2 14.06,14.25 arc(14.38,14.47) 14.77,14.55 U6.4 15.34,12.87 15.79,12.42
  vias: v1(2.38,20.79) v1(2.96,13.69) v1(5.31,17.89) v1(5.31,16.61) v1(6.07,17.89) v1(6.07,16.61) v1(6.84,17.89) v1(6.84,16.61) v1(7.09,10.92) v1(7.43,25.43) v1(16.62,5.95) v1(17.88,28.58) v1(25.12,3.65) v1(31.09,9.56) v2(1.9,11.89) v2(3.9,24.89) v2(4.9,27.89) v2(5.9,28.89) v2(5.9,27.89) v2(5.9,26.89) v2(5.9,9.89) v2(6.9,27.89) v2(7.9,30.89) v2(7.9,10.89) v2(7.9,3.89) v2(8.9,30.89) v2(8.9,29.89) v2(8.9,4.89) v2(8.9,3.89) v2(9.9,31.89) v2(9.9,30.89) v2(9.9,29.89) v2(9.9,28.89) v2(9.9,27.89) v2(9.9,4.89) v2(9.9,3.89) v2(10.9,31.89) v2(10.9,30.89) v2(10.9,29.89) v2(10.9,28.89) v2(10.9,27.89) v2(10.9,4.89) v2(11.9,32.89) v2(11.9,31.89) v2(11.9,30.89) v2(11.9,29.89) v2(11.9,28.89) v2(11.9,27.89) v2(11.9,16.89) v2(11.9,5.89) v2(11.9,4.89) v2(11.9,2.89) v2(11.9,1.89) v2(12.9,28.89) v2(12.9,27.89) v2(12.9,24.89) v2(12.9,9.89) v2(12.9,8.89) v2(12.9,5.89) v2(12.9,4.89) v2(13.9,28.89) v2(13.9,27.89) v2(13.9,22.89) v2(13.9,5.89) v2(13.9,4.89) v2(14.9,24.89) v2(14.9,23.89) v2(14.9,3.89) v2(14.9,2.89) v2(14.9,1.89) v2(14.9,0.89) v2(15.9,2.89) v2(15.9,1.89) v2(15.9,0.89) v2(16.9,32.89) v2(16.9,31.89) v2(16.9,30.89) v2(16.9,2.89) v2(16.9,1.89) v2(16.9,0.89) v2(17.9,32.89) v2(17.9,31.89) v2(17.9,30.89) v2(17.9,2.89) v2(17.9,1.89) v2(17.9,0.89) v2(18.9,8.89) v2(18.9,2.89) v2(18.9,1.89) v2(18.9,0.89) v2(19.9,0.89) v2(20.9,28.89) v2(20.9,27.89) v2(20.9,26.89) v2(21.9,28.89) v2(21.9,27.89) v2(21.9,26.89) v2(21.9,25.89) v2(22.9,31.89) v2(22.9,1.89) v2(23.9,31.89) v2(23.9,3.89) v2(24.9,31.89) v2(27.9,29.89) v2(28.9,28.89) v2(28.9,27.89) v2(29.9,27.89) v2(29.9,6.89) v2(30.9,7.89) v2(31.9,9.89) v2(32.9,11.89)
VBAT: length 35.9
  Top Layer w0.254: v1(15.34,31.09) 16.07,30.37 arc(16.39,30.15) 16.78,30.08 23.54,30.08 C21.2
  Top Layer w0.3: 31.93,19.53 33.37,19.53 v1(33.51,19.66) v1(33.51,20.3) 33.51,21.03 arc(33.43,21.41) 33.21,21.73 32.87,22.08 32.11,22.08 31.64,22.55 arc(31.42,22.87) 31.35,23.25 31.35,24.71 arc(31.27,25.09) 31.05,25.42 29.99,26.48 arc(29.66,26.7) 29.28,26.78 28.59,26.78 arc(28.2,26.85) 27.88,27.07 27.58,27.37 arc(27.36,27.7) 27.28,28.08 27.28,28.65 arc(27.21,29.03) 26.99,29.35 26.62,29.72 arc(26.3,29.94) 25.91,30.02 C23.2 ; 31.93,14.97 33.37,14.97 v1(33.51,14.84) v1(33.51,14.2)
  Top Layer w0.5: C21.2 C23.2
  Inner1 w0.4: v1(33.51,14.84) 33.06,14.84 32.66,15.24 arc(32.44,15.56) 32.36,15.94 32.36,19.09 32.94,19.66 v1(33.51,19.66)
  vias: v1(14.71,32.36) v1(14.71,31.73) v1(14.71,31.09) v1(15.34,32.36) v1(15.34,31.73)
VCC: length 112.4
  Top Layer w0.254: C25.1 12.95,20.94 12.96,20.92 12.93,20.95 v1(12.93,22.08) ; C25.1 12.01,20.27 U5.6 13.82,20.27 14.2,19.89 14.2,16.11 13.65,15.56 U4.5 11.68,15.56 C24.1 ; C25.1 10.21,20.94 v1(7.98,23.16) 7.34,22.53 7.34,22.03 U1.36 ; C24.1 11.53,14.91 U4.6 13.37,14.91 arc(13.75,14.83) 14.07,14.61 15.04,13.64 arc(15.37,13.43) 15.75,13.35 16.58,13.35 arc(16.96,13.28) 17.28,13.06 17.66,12.68 v1(18.27,12.68) 18.74,12.68 arc(19.12,12.6) 19.45,12.39 19.75,12.08 arc(19.97,11.76) 20.04,11.38 20.04,10.81 arc(20.12,10.42) 20.34,10.1 23.09,7.34 23.09,6.87 LED1.2 ; C24.1 11.28,16.31 U1.24 ; 22.8,6.84 19.5,10.14 L1.1 ; 22.8,6.84 LED1.2 ; 22.8,6.84 22.55,6.58 21.73,6.58 arc(21.35,6.66) 21.02,6.88 20.97,6.92 arc(20.65,7.14) 20.26,7.22 11.44,7.22 arc(11.06,7.29) 10.73,7.51 10.69,7.56 arc(10.36,7.78) 9.98,7.85 9.22,7.85 arc(8.83,7.93) 8.51,8.14 C7.2 7.09,8.36 6.57,7.84 R2.1 4.72,7.84 arc(4.34,7.92) 4.01,8.14 3.61,8.54 arc(3.39,8.86) 3.31,9.25 3.31,10 ; LED1.2 23.09,6.54 C11.2 C13.2 25.19,5 26.24,6.04 U3.5 ; 2.4,23.36 2.4,22.88 arc(2.33,22.5) 2.11,22.18 0.87,20.93 0.87,20.32 1.39,19.8 1.39,18.42 U1.48 ; 2.4,23.36 3.55,22.22 3.55,22.09 ; 2.4,23.36 2.4,24.09 arc(2.48,24.47) 2.7,24.8 3.97,26.07 SW1.2
  Inner1 w0.254: v1(7.98,23.16) 5.04,23.16 arc(4.65,23.09) 4.33,22.87 v1(3.67,22.22)
  Bottom Layer w0.254: C17.2 17.19,12.24 16.62,11.66 14.93,11.66 arc(14.55,11.74) 14.22,11.95 C22.1 ; C17.2 17.79,11.82 arc(17.83,11.8) 17.86,11.79 18.61,11.79 arc(18.64,11.8) 18.68,11.82 19.13,12.27 arc(19.15,12.3) 19.16,12.34 U6.1 ; C17.2 17.88,13.11 U6.2 ; C17.2 18.01,12.42 v1(18.27,12.68) ; v1(12.93,22.08) 14.59,22.08 R8.2 15.44,22.93 arc(15.77,23.14) 16.15,23.22 18.35,23.22 arc(18.73,23.14) 19.06,22.93 R7.2
VDDA: length 18.5
  Top Layer w0.127: v1(4.3,13.19) 4.3,13.33 U1.9
  Top Layer w0.254: v1(14.52,8.49) L1.2
  Inner2 w0.127: v1(4.3,13.19) 4.3,8.49 5.44,7.34 13.38,7.34 v1(14.52,8.49)
BOOT0: length 16.4
  Top Layer w0.127: U1.44 3.1,19.54 2.65,19.54 1.5,20.68 1.5,21.06 2.14,21.69 2.71,21.69 3.03,21.37 3.85,21.37 6.29,23.81 arc(6.51,24.14) 6.58,24.52 6.58,25.34 arc(6.66,25.73) 6.88,26.05 7.05,26.23 arc(7.38,26.44) 7.76,26.52 8.45,26.52 8.49,26.56
  Top Layer w0.254: 8.49,26.56 8.49,28.46 7.69,29.26
MOTOR_A: length 20.3
  Top Layer w0.254: U4.2 19.35,14.26 20.51,13.1 R4.2
  Top Layer w0.4: R4.2 22.67,14.97 arc(22.89,15.29) 22.97,15.68 22.97,20.9 arc(22.89,21.28) 22.67,21.61 21.99,22.29 arc(21.66,22.51) 21.28,22.58 20.97,22.58 arc(20.58,22.66) 20.26,22.88 17.25,25.89 v3(17.25,26.25) v1(17.25,27.16)
  vias: v1(20.81,13.03)
MOTOR_A_CS: length 18.5
  Top Layer w0.254: v1(22.27,16.06) v1(20.81,16.06) 20.51,16.06 19.35,14.91 U4.3
  Top Layer w0.3: v1(33.51,16.18) v1(33.51,15.6) 31.95,15.6 31.93,15.62
  Bottom Layer w0.4: 23.47,14.74 22.27,15.94 ; 24.77,14.2 30.81,14.2 arc(31.19,14.28) 31.51,14.5 32.2,15.18 arc(32.52,15.4) 32.9,15.47 33.51,15.47 ; 24.78,14.21 arc(24.07,14.35) 23.47,14.75
MOTOR_B: length 26.2
  Top Layer w0.3: 31.93,17.58 33.44,17.58 v1(33.51,17.5) v1(33.51,16.87)
  Bottom Layer w0.254: v3(18.75,26.25) 18.74,26.26 v1(18.74,27.16)
  Bottom Layer w0.4: v1(33.51,16.87) 32.74,16.87 31.13,15.26 arc(30.81,15.04) 30.43,14.96 25.92,14.96 arc(25.54,15.04) 25.21,15.26 25.16,15.31 arc(24.84,15.52) 24.46,15.6 24.4,15.6 arc(24.01,15.68) 23.69,15.89 21.86,17.72 arc(21.64,18.04) 21.57,18.43 21.57,22.17 arc(21.49,22.55) 21.28,22.88 19.07,25.08 arc(18.85,25.41) 18.77,25.79 18.77,26.23 v3(18.75,26.25)
MOTOR_C: length 10.5
  Top Layer w0.254: R5.1 20.54,21.43 19.38,20.27 U5.3
  Top Layer w0.4: R5.1 20.57,21.43 v3(15.75,26.25) v1(15.75,27.17)
MOTOR_C_CS: length 18.2
  Top Layer w0.254: 18.82,19.62 19.45,19.62 20.6,18.47 R5.2 20.94,18.39 v1(22.27,18.39)
  Top Layer w0.3: v1(33.51,18.27) 33.47,18.22 31.93,18.22
  Top Layer w0.5: v1(33.51,18.97) v1(33.51,18.27)
  Bottom Layer w0.4: v1(22.27,18.39) 23.25,19.37 arc(23.57,19.59) 23.96,19.66 30.04,19.66 arc(30.43,19.59) 30.75,19.37 30.86,19.26 arc(31.18,19.05) 31.56,18.97 v1(33.51,18.97)
  vias: v1(20.86,18.4)
NRST: length 14.3
  Top Layer w0.127: v1(3.79,12.68) 3.79,14.24 U1.7
  Top Layer w0.254: C6.1 9.08,6.11 arc(8.76,5.9) 8.37,5.82 7.5,5.82 SW2.1 6.57,6.34 R2.2
  Inner2 w0.254: v1(5.69,6.3) 3.79,8.2 v1(3.79,12.68)
OSCIN: length 6
  Top Layer w0.127: U1.5 3.06,14.92 2.09,14.92 1.63,14.46 1.63,13.76 C8.2 1.56,13.55 U2.3
PA8: length 19.6
  Top Layer w0.127: v1(24.24,13.57) 26.09,13.57 U13.27 ; U1.29 9.84,19.58 10.06,19.58 v1(10.26,19.79)
  Inner1 w0.254: v1(24.24,13.57) 16.9,13.57 16.79,13.68 arc(16.41,13.75) 16.09,13.97 v1(10.26,19.79)
PA9: length 19.9
  Top Layer w0.127: v1(9.76,20.3) 9.06,19.61 9.06,19.51 ; U13.25 26.19,14.97 v1(24.24,14.97)
  Inner1 w0.254: v1(9.76,20.3) 10.13,20.67 11.12,20.67 arc(11.51,20.6) 11.83,20.38 16.95,15.26 arc(17.28,15.05) 17.66,14.97 v1(24.24,14.97)
PA10: length 20.1
  Top Layer w0.127: U13.23 26.15,16.23 v1(24.24,16.23) ; v1(9.25,20.81) 9.25,20.4 8.71,19.86
  Inner1 w0.254: v1(24.24,16.23) 23.73,16.74 16.9,16.74 arc(16.52,16.82) 16.19,17.03 12.46,20.77 arc(12.14,20.98) 11.76,21.06 9.5,21.06 v1(9.25,20.81)
PA11: length 28.8
  Top Layer w0.127: v1(23.98,17.5) 23.91,17.43 23.91,16.92 ; U13.26 23.86,14.33 23.6,14.58 23.6,15.34 23.88,15.62 ; 23.88,15.62 U13.24 ; 23.88,15.62 23.6,15.91 23.6,16.61 23.91,16.92 ; 23.91,16.92 U13.22 ; v1(8.74,21.31) 8.74,20.6 8.36,20.22
  Inner1 w0.254: v1(23.98,17.5) 16.9,17.5 arc(16.52,17.58) 16.19,17.8 12.72,21.28 arc(12.39,21.49) 12.01,21.57 9,21.57 v1(8.74,21.31)
PA15: length 14
  Top Layer w0.127: U1.38 5.31,21.57 5.31,21.95 9.34,25.97 arc(9.66,26.19) 10.04,26.27 13.53,26.27 arc(13.92,26.34) 14.24,26.56 15.08,27.4 arc(15.3,27.73) 15.38,28.11 15.38,28.58
PB2: length 7.2
  Top Layer w0.127: R3.1 13.61,12.51 arc(13.29,12.73) 12.91,12.81 10.65,12.81 10.26,13.19 10.26,14.08 arc(10.19,14.46) 9.97,14.79 U1.20
PB3: length 18.1
  Top Layer w0.127: U1.39 4.8,21.37 4.8,21.82 9.21,26.23 arc(9.53,26.44) 9.92,26.52 13.41,26.52 arc(13.79,26.6) 14.11,26.81 14.54,27.24 arc(14.76,27.57) 14.84,27.95 14.84,29.64 15.02,29.82 15.85,29.82 16.62,29.05 16.62,28.58
PB6: length 20.5
  Top Layer w0.127: 4.19,19.86 3.79,20.26 v5(3.79,20.81)
  Inner2 w0.254: v1(18.27,22.2) 17.64,22.84 14.84,22.84 11.15,19.16 5.44,19.16 v5(3.79,20.81)
  Bottom Layer w0.254: U6.7 17.88,21.81 v1(18.27,22.2)
PB7: length 18.4
  Top Layer w0.127: 3.84,19.51 3.81,19.51 v5(3.15,20.17)
  Inner2 w0.254: v1(16.23,22.2) 14.84,22.2 11.41,18.77 4.55,18.77 v5(3.15,20.17)
  Bottom Layer w0.254: v1(16.23,22.2) 16.62,21.81 U6.6
PB11: length 11.5
  Top Layer w0.127: U1.22 10.52,15.66 10.52,13.36 10.82,13.06 16.46,13.06 arc(16.84,12.98) 17.16,12.77 17.82,12.11 ; 17.82,12.11 C1.2
SENSOR_A: length 10.4
  Top Layer w0.127: U1.10 4.8,13.13 v1(4.8,12.68)
  Inner2 w0.254: v1(12.42,13.57) 12.04,13.19 8.49,13.19 6.69,11.39 5.59,11.39 4.8,12.17 v1(4.8,12.68)
SENSOR_C: length 11.4
  Top Layer w0.127: U1.11 5.31,12.93 5.31,12.55 v1(5.95,11.92)
  Inner2 w0.254: v1(5.95,11.92) 5.95,12.42 v4(12.42,18.9)
SWCLK: length 24.3
  Top Layer w0.127: v1(6.6,22.33) 5.96,21.69 U1.37
  Inner1 w0.254: v1(19.12,5.92) 19.12,5.92 18.81,5.61 arc(18.49,5.39) 18.11,5.31 17.5,5.31 17.25,5.57 17.25,9.22 arc(17.17,9.6) 16.96,9.92 6.89,19.99 arc(6.68,20.31) 6.6,20.69 v1(6.6,22.33)
SWDIO: length 21.2
  Top Layer w0.127: v1(8.11,21.95) 8.11,21.38 U1.34
  Inner1 w0.254: v1(8.11,21.95) 8.11,20.2 arc(8.18,19.82) 8.4,19.5 17.58,10.31 arc(17.8,9.99) 17.88,9.61 v1(17.88,5.92)
$1N2682: length 3.3
  Bottom Layer w0.254: U6.5 15.34,18.52 14.83,18 R6.2
$1N3815: length 17.6
  Top Layer w0.254: 31.93,13.03 33.09,13.03 v1(33.38,13.31)
  Inner1 w0.4: v1(28.06,23.35) 27.54,22.82 27.54,15.89 arc(27.61,15.5) 27.83,15.18 28.77,14.24 arc(28.98,13.92) 29.06,13.53 29.06,13.35 arc(29.14,12.96) 29.35,12.64 29.4,12.59 arc(29.73,12.37) 30.11,12.3 31.95,12.3 arc(32.33,12.37) 32.66,12.59 v1(33.38,13.31)
$1N3819: length 12.9
  Top Layer w0.254: 31.93,13.67 31.2,13.67 30.59,13.06 v1(29.95,13.06)
  Inner1 w0.4: v1(30.14,23.35) 30.59,22.9 30.59,14.11 arc(30.51,13.73) 30.29,13.4 v1(29.95,13.06)
$1N3846: length 21
  Top Layer w0.254: v1(28.26,13.17) 28.79,13.7 30.18,13.7 arc(30.56,13.78) 30.89,14 31.22,14.33 31.93,14.33 ; v1(26.52,27.92) 26.01,27.92 25.38,28.55 C23.1
  Inner1 w0.4: v1(26.52,27.92) 26.52,15.32 arc(26.6,14.94) 26.81,14.62 v1(28.26,13.17)
$1N3991: length 11
  Top Layer w0.254: U13.18 25.26,19.53 25,19.79 25,21.69 25.25,21.95 25.76,21.95 26.1,22.29 arc(26.32,22.62) 26.39,23 26.39,25.09 arc(26.32,25.47) 26.1,25.8 25.93,25.97 arc(25.6,26.19) 25.22,26.27 24.91,26.27 arc(24.53,26.34) 24.2,26.56 R9.1
$1N3994: length 9.4
  Top Layer w0.254: U13.15 26.68,21.47 26.78,21.57 26.78,24.68 C20.2
  Top Layer w0.3: U13.15 U13.16 U13.17
  Top Layer w0.5: R9.2 26.33,27.03 C20.2
$1N4536: length 6.4
  Top Layer w0.254: LED1.1 24.78,6.96 26.77,6.96 27.28,7.48 27.28,8.23 28.56,9.51 R11.2

## Copper pours and planes (outline as drawn; the poured copper is in the pictures)
AGND on Top Layer: 18.88,32.74 20.04,32.74 20.04,30.95 18.88,30.95
AGND on Bottom Layer: 18.75,33.25 20.75,33.25 20.75,30.25 18.75,30.25
AGND on Inner2: outline of 144 points within -2.11,-2.12 36.61,36.6
GND on Top Layer: outline of 152 points within -4.18,-4.19 38.68,38.67
GND on Bottom Layer: outline of 168 points within -9.72,-9.73 44.22,44.21
GND on Inner1: outline of 160 points within -6.63,-6.64 41.13,41.12
VBAT on Top Layer: 14.46,32.62 15.6,32.62 15.6,30.84 14.46,30.84
VBAT on Bottom Layer: 13.75,33.25 15.75,33.25 15.75,30.25 13.75,30.25

Small or netless copper shapes (teardrops, artwork), in the pictures only: 194 on Top Layer, 18 on Bottom Layer, 4 on Inner1, 10 on Inner2

## Text on the board
Bottom Silkscreen Layer: C | A | B | V | G
Top Silkscreen Layer: V0.0.2 | TINY
